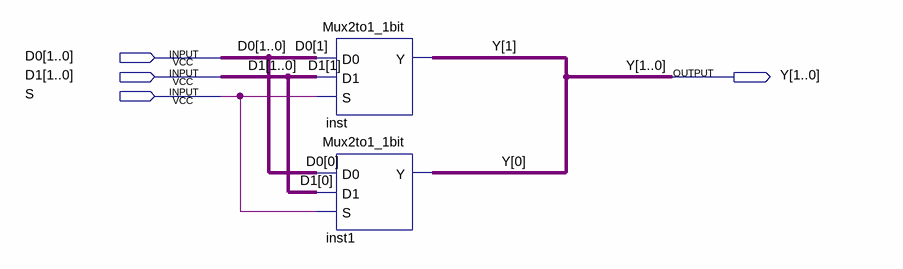
[diagram p0: schematic sheet]
// Quartus schematic Mux2to1_2bit.bdf as structural Verilog: 2 symbols, 4 pins
module Mux2to1_2bit (
  input  [1:0] D0,
  input  [1:0] D1,
  input  S,
  output [1:0] Y
);

  Mux2to1_1bit inst (.D0(D0[1]), .D1(D1[1]), .S(S), .Y(Y[1]));
  Mux2to1_1bit inst1 (.D0(D0[0]), .D1(D1[0]), .S(S), .Y(Y[0]));
endmodule
